# Altium schematic sheet RPi_connector_board.SchDoc
size A3; SheetNumber: 1; SheetTotal: 1
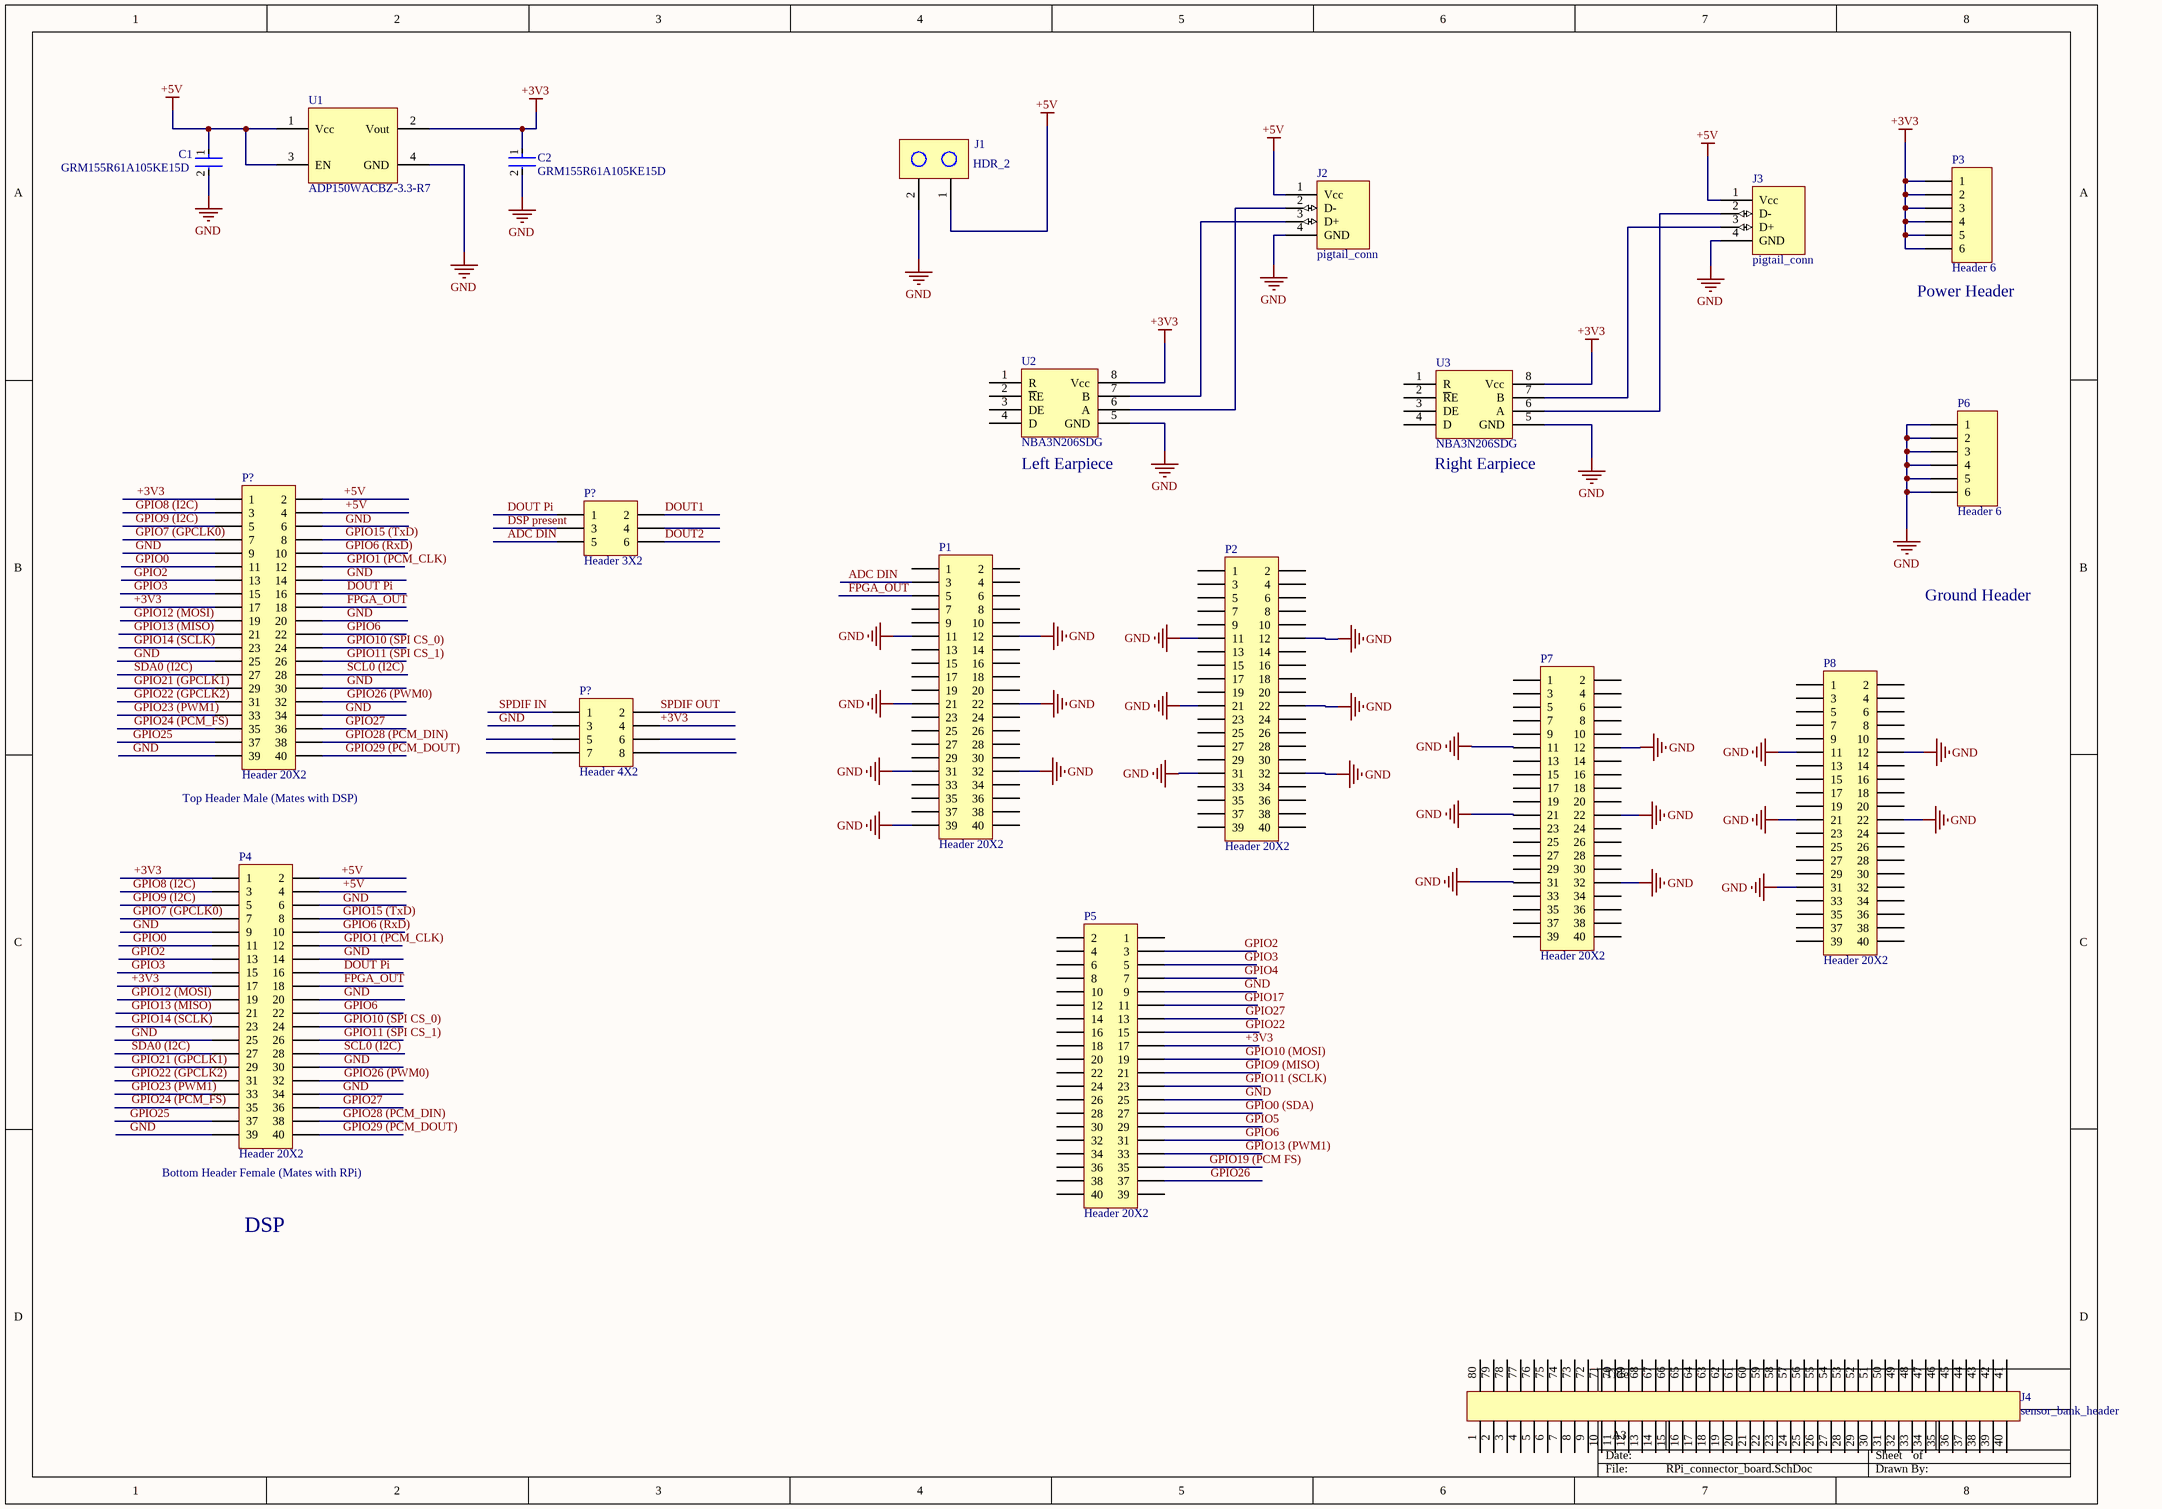
[diagram p0: RPi_connector_board.SchDoc]

## Parts
(Parts that share a designator on the sheet are numbered #1, #2 ... from top to bottom, then left to right.)
C1  GRM155R61A105KE15D  [FP-GRM15-0_1-MFG]
C2  GRM155R61A105KE15D  [FP-GRM15-0_1-MFG]
J1  HDR_2  [2-POS_HEADER]
J2  pigtail_conn  [4-pos RA Thru-hole]
J3  pigtail_conn  [4-pos RA Thru-hole]
J4  sensor_bank_header
P1  Header 20X2  [HDR2X20]
P2  Header 20X2  [HDR2X20]
P3  Header 6  [HDR1X6]
P4  Header 20X2  [HDR2X20]
P5  Header 20X2  [HDR2X20]
P6  Header 6  [HDR1X6]
P7  Header 20X2  [HDR2X20]
P8  Header 20X2  [HDR2X20]
P?#1  Header 20X2  [HDR2X20]
P?#2  Header 3X2  [HDR2X3]
P?#3  Header 4X2  [HDR2X4]
U1  ADP150WACBZ-3.3-R7
U2  NBA3N206SDG  [8-SOIC]
U3  NBA3N206SDG  [8-SOIC]

## Nets
+3V3: C2.1 P3.1 P3.2 P3.3 P3.4 P3.5 P3.6 P4.1 P4.17 P5.17 P?#1.1 P?#1.17 P?#3.4 U1.2(Vout) U2.8(Vcc) U3.8(Vcc)
+5V: C1.1 J1.1 J2.1(Vcc) J3.1(Vcc) P4.2 P4.4 P?#1.2 P?#1.4 U1.1(Vcc) U1.3(EN)
GND: C1.2 C2.2 J1.2 J2.4(GND) J3.4(GND) P1.11 P1.12 P1.21 P1.22 P1.31 P1.32 P1.39 P2.11 P2.12 P2.21 P2.22 P2.31 P2.32 P4.6 P4.9 P4.14 P4.20 P4.25 P4.30 P4.34 P4.39 P5.9 P5.25 P6.1 P6.2 P6.3 P6.4 P6.5 P6.6 P7.11 P7.12 P7.21 P7.22 P7.31 P7.32 P8.11 P8.12 P8.21 P8.22 P8.31 P?#1.6 P?#1.9 P?#1.14 P?#1.20 P?#1.25 P?#1.30 P?#1.34 P?#1.39 P?#3.3 U1.4(GND) U2.5(GND) U3.5(GND)
ADC DIN: P1.3 P?#2.5
DOUT1: P?#2.2
DOUT2: P?#2.6
DOUT Pi: P4.16 P?#1.16 P?#2.1
DSP present: P?#2.3
FPGA_OUT: P1.5 P4.18 P?#1.18
GPIO0: P4.11 P?#1.11
GPIO0 (SDA): P5.27
GPIO1 (PCM_CLK): P4.12 P?#1.12
GPIO2: P4.13 P5.3 P?#1.13
GPIO3: P4.15 P5.5 P?#1.15
GPIO4: P5.7
GPIO5: P5.29
GPIO6: P4.22 P5.31 P?#1.22
GPIO6 (RxD): P4.10 P?#1.10
GPIO7 (GPCLK0): P4.7 P?#1.7
GPIO8 (I2C): P4.3 P?#1.3
GPIO9 (I2C): P4.5 P?#1.5
GPIO9 (MISO): P5.21
GPIO10 (MOSI): P5.19
GPIO10 (SPI CS_0): P4.24 P?#1.24
GPIO11 (SCLK): P5.23
GPIO11 (SPI CS_1): P4.26 P?#1.26
GPIO12 (MOSI): P4.19 P?#1.19
GPIO13 (MISO): P4.21 P?#1.21
GPIO13 (PWM1): P5.33
GPIO14 (SCLK): P4.23 P?#1.23
GPIO15 (TxD): P4.8 P?#1.8
GPIO17: P5.11
GPIO19 (PCM FS): P5.35
GPIO21 (GPCLK1): P4.29 P?#1.29
GPIO22: P5.15
GPIO22 (GPCLK2): P4.31 P?#1.31
GPIO23 (PWM1): P4.33 P?#1.33
GPIO24 (PCM_FS): P4.35 P?#1.35
GPIO25: P4.37 P?#1.37
GPIO26: P5.37
GPIO26 (PWM0): P4.32 P?#1.32
GPIO27: P4.36 P5.13 P?#1.36
GPIO28 (PCM_DIN): P4.38 P?#1.38
GPIO29 (PCM_DOUT): P4.40 P?#1.40
SCL0 (I2C): P4.28 P?#1.28
SDA0 (I2C): P4.27 P?#1.27
SPDIF IN: P?#3.1
SPDIF OUT: P?#3.2
NetJ2_2: J2.2(D-) U2.6(A)
NetJ2_3: J2.3(D+) U2.7(B)
NetJ3_2: J3.2(D-) U3.6(A)
NetJ3_3: J3.3(D+) U3.7(B)

Not connected (* = marked no-connect by the designer): J4 1 2 3 4 5 6 7 8 9 10 11 12 13 14 15 16 17 18 19 20 21 22 23 24 25 26 27 28 29 30 31 32 33 34 35 36 37 38 39 40 41 42 43 44 45 46 47 48 49 50 51 52 53 54 55 56 57 58 59 60 61 62 63 64 65 66 67 68 69 70 71 72 73 74 75 76 77 78 79 80; P1 1 2 4 6 7 8 9 10 13 14 15 16 17 18 19 20 23 24 25 26 27 28 29 30 33 34 35 36 37 38 40; P2 1 2 3 4 5 6 7 8 9 10 13 14 15 16 17 18 19 20 23 24 25 26 27 28 29 30 33 34 35 36 37 38 39 40; P5 1 2 4 6 8 10 12 14 16 18 20 22 24 26 28 30 32 34 36 38 39 40; P7 1 2 3 4 5 6 7 8 9 10 13 14 15 16 17 18 19 20 23 24 25 26 27 28 29 30 33 34 35 36 37 38 39 40; P8 1 2 3 4 5 6 7 8 9 10 13 14 15 16 17 18 19 20 23 24 25 26 27 28 29 30 32 33 34 35 36 37 38 39 40; P?#2 4; P?#3 5 6 7 8; U2 1(R) 2(~{R}E) 3(DE) 4(D); U3 1(R) 2(~{R}E) 3(DE) 4(D)

## Notes on the sheet
- (near P3) Power Header
- (near U2) Left Earpiece
- (near U3) Right Earpiece
- Ground Header
- (near P?#1) Top Header Male (Mates with DSP)
- (near P4) Bottom Header Female (Mates with RPi)
- DSP

## Library data of the parts
C1 C2 = CMP-2008-04556-2: CAP CER 1UF 10V X5R 0402; Manufacturer: Murata; Material: Ceramic; Tolerance: 10%; Temperature Coefficient: 15%; Octopart: https://octopart.com/grm155r61a105ke15d-murata-197442; Manufacturer Part Number: GRM155R61A105KE15D; Lead Free: Yes; ComponentLink2Description: Datasheet; Temperature: -55°C to +85°C; Temperature Range High: +85°C; Height: 0.55mm; Capacitance: 1uF; Ipc Land Pattern Name: CAPC10050X50; ComponentLink2URL: https://search.murata.co.jp/Ceramy/image/img/A01X/G101/ENG/GRM155R61A105KE15-01A.pdf; Temperature Range Low: -55°C; Device Class L2: Capacitors; Voltage Rating: 10V; RoHS: TRUE; Device Class L1: Passive Components; Device Class L3: Ceramic Capacitors; Temperature Characteristic: X5R; Mouser Description: 0402 1 uF 10 V ±10% Tolerance X5R Surface Mount Multilayer Ceramic Capacitor; Automotive: No; Package: GRM15-0.1; Digikey Description: CAP CER 1UF 10V X5R 0402; Value: 1uF; Category: Cap
J1 = HDR_2: 2-pin 0.1" header
J2 J3 = pigtail_conn: Earpiece board connector
J4 = sensor_bank_header: Female pin header for sensors
P1 P2 P4 P5 P7 P8 P?#1 = Header 20X2: Header, 20-Pin, Dual row; LatestRevisionDate: 17-Jul-2002; LatestRevisionNote: Re-released for DXP Platform.; Publisher: Altium Limited
P3 P6 = Header 6: Header, 6-Pin; LatestRevisionDate: 17-Jul-2002; LatestRevisionNote: Re-released for DXP Platform.; Publisher: Altium Limited
P?#2 = Header 3X2: Header, 3-Pin, Dual row; LatestRevisionDate: 17-Jul-2002; LatestRevisionNote: Re-released for DXP Platform.; Publisher: Altium Limited
P?#3 = Header 4X2: Header, 4-Pin, Dual row; LatestRevisionDate: 17-Jul-2002; LatestRevisionNote: Re-released for DXP Platform.; Publisher: Altium Limited
U1 = ADP150WACBZ-3.3-R7: Linear Voltage Regulator IC Positive Fixed 1 Output 150mA 4-WLCSP (0.76x0.76)
U2 U3 = NBA3N206SDG: 1/1 Transceiver Half LVDS, Multipoint 8-SOIC